# Altium schematic sheet XMAS_2023_SCH.SchDoc
size A4; SheetNumber: 1; SheetTotal: 1
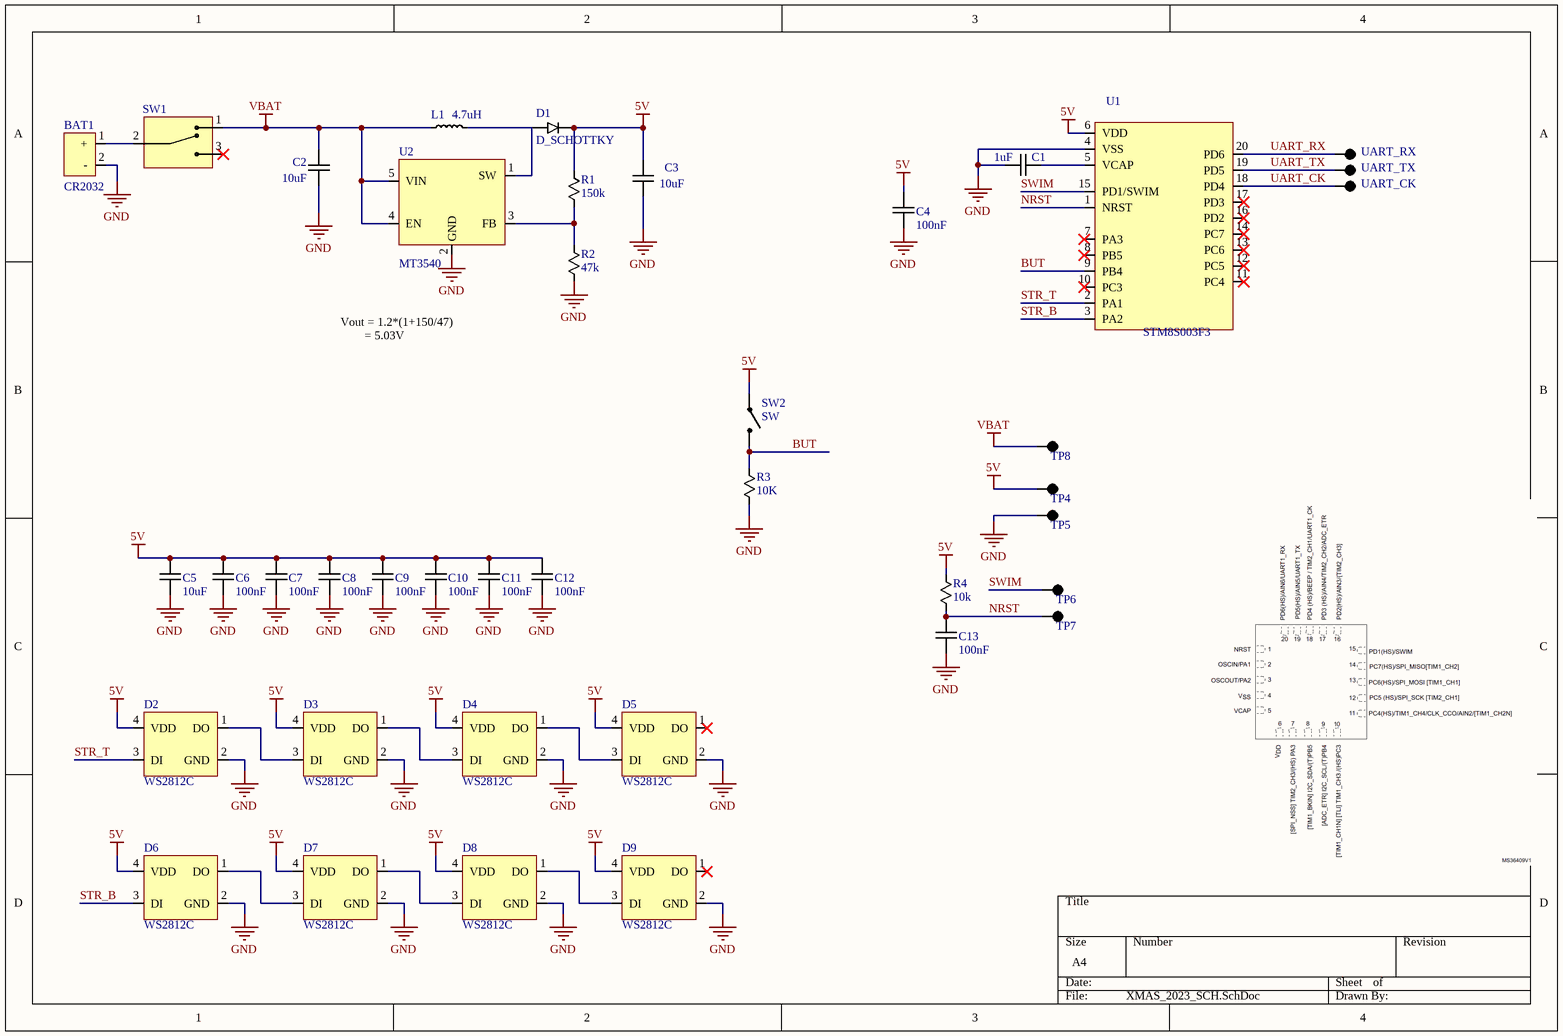
[diagram p0: XMAS_2023_SCH.SchDoc]

## Parts
BAT1  CR2032  [BAT_2032]
C1  1uF  [CAP_0805_NOM]
C2  10uF  [CAP_0805_NOM]
C3  10uF  [CAP_0805_NOM]
C4  100nF  [CAP_0805_NOM]
C5  10uF  [CAP_0805_NOM]
C6  100nF  [CAP_0805_NOM]
C7  100nF  [CAP_0805_NOM]
C8  100nF  [CAP_0805_NOM]
C9  100nF  [CAP_0805_NOM]
C10  100nF  [CAP_0805_NOM]
C11  100nF  [CAP_0805_NOM]
C12  100nF  [CAP_0805_NOM]
C13  100nF  [CAP_0805_NOM]
D1  D_SCHOTTKY  [SOD-523]
D2  WS2812C  [LED_RGB_WS2812C-2020]
D3  WS2812C  [LED_RGB_WS2812C-2020]
D4  WS2812C  [LED_RGB_WS2812C-2020]
D5  WS2812C  [LED_RGB_WS2812C-2020]
D6  WS2812C  [LED_RGB_WS2812C-2020]
D7  WS2812C  [LED_RGB_WS2812C-2020]
D8  WS2812C  [LED_RGB_WS2812C-2020]
D9  WS2812C  [LED_RGB_WS2812C-2020]
L1  4.7uH  [CAP_0805_NOM]
R1  150k  [RES_0805_nom]
R2  47k  [RES_0805_nom]
R3  10K  [RES_0805_nom]
R4  10k  [RES_0805_nom]
SW1  SW_SLIDE_SPDT_MK-12C02-G025  [SW_SLIDE_SPDT_MK-12C02-G025]  (value not drawn)
SW2  SW  [SW_TACT_SPST_TS-1187A]
TP1  UART_RX  [testpoint]  (no BOM)
TP2  UART_TX  [testpoint]  (no BOM)
TP3  UART_CK  [testpoint]  (no BOM)
TP4  TESTPOINT  [testpoint]  (value not drawn)  (no BOM)
TP5  TESTPOINT  [testpoint]  (value not drawn)  (no BOM)
TP6  TESTPOINT  [testpoint]  (value not drawn)  (no BOM)
TP7  TESTPOINT  [testpoint]  (value not drawn)  (no BOM)
TP8  TESTPOINT  [testpoint]  (value not drawn)  (no BOM)
U1  STM8S003F3  [UFQFPN20]
U2  MT3540  [SOT-23 - 5]

## Nets
5V: C3.2 C4.2 C5.2 C6.2 C7.2 C8.2 C9.2 C10.2 C11.2 C12.2 D1.1(Cathode) D2.4(VDD) D3.4(VDD) D4.4(VDD) D5.4(VDD) D6.4(VDD) D7.4(VDD) D8.4(VDD) D9.4(VDD) R1.2 R4.2 SW2.1 TP4.1 U1.6(VDD)
GND: BAT1.2(-) C1.1 C2.1 C3.1 C4.1 C5.1 C6.1 C7.1 C8.1 C9.1 C10.1 C11.1 C12.1 C13.1 D2.2(GND) D3.2(GND) D4.2(GND) D5.2(GND) D6.2(GND) D7.2(GND) D8.2(GND) D9.2(GND) R2.1 R3.1 TP5.1 U1.4(VSS) U2.2(GND)
VBAT: C2.2 L1.1 SW1.1(A) TP8.1 U2.4(EN) U2.5(VIN)
BUT: R3.2 SW2.2 U1.9(PB4)
NRST: C13.2 R4.1 TP7.1 U1.1(NRST)
STR_B: D6.3(DI) U1.3(PA2)
STR_T: D2.3(DI) U1.2(PA1)
SWIM: TP6.1 U1.15(PD1/SWIM)
UART_CK: TP3.1 U1.18(PD4)
UART_RX: TP1.1 U1.20(PD6)
UART_TX: TP2.1 U1.19(PD5)
NetBAT1_1: BAT1.1(+) SW1.2(COM)
NetC1_2: C1.2 U1.5(VCAP)
NetD1_2: D1.2(Anode) L1.2 U2.1(SW)
NetD2_1: D2.1(DO) D3.3(DI)
NetD3_1: D3.1(DO) D4.3(DI)
NetD4_1: D4.1(DO) D5.3(DI)
NetD6_1: D6.1(DO) D7.3(DI)
NetD7_1: D7.1(DO) D8.3(DI)
NetD8_1: D8.1(DO) D9.3(DI)
NetR1_1: R1.1 R2.2 U2.3(FB)

Not connected (* = marked no-connect by the designer): D5 1(DO)*; D9 1(DO)*; SW1 3(B)*; U1 7(PA3)* 8(PB5)* 10(PC3)* 11(PC4)* 12(PC5)* 13(PC6)* 14(PC7)* 16(PD2)* 17(PD3)*

## Notes on the sheet
- Vout = 1.2*(1+150/47)
  = 5.03V

## Library data of the parts
BAT1 = BAT_CR2032: Manufacturer: MYOUNG; Manufacturer Part Number: MY-2032-12; JLCPCB Part Number: C964833
C1-C13 = CAP_0805_10V
D1 = D_SCHOTTKY: 30V 500mV@200mA 200mA SOD-523 Schottky Barrier Diodes (SBD) ROHS; Manufacturer: onsemi; Manufacturer Part Number: RB521S30T1G; JLCPCB Part Number: C145179
D2-D9 = LED_RGB_WS2812C-2020: RGB SMD,2x2mm Light Emitting Diodes (LED) ROHS; Manufacturer: Worldsemi; Manufacturer Part Number: WS2812C-2020-V1; JLCPCB Part Number: C2976072
L1 = IND_4.7uH_0805: 350mA 4.7uH ±20% 400mΩ 0805 Inductors (SMD) ROHS; Manufacturer: FH (Guangdong Fenghua Advanced Tech); Manufacturer Part Number: CMP201209UD4R7MT; JLCPCB Part Number: C139243
R1-R4 = RES_0805
SW1 = SW_SLIDE_SPDT_MK-12C02-G025: Manufacturer: G-Switch; Manufacturer Part Number: MK-12C02-G025; JLCPCB Part Number: C778186
SW2 = SW_SPST_TACT_TS_1187A: No NO 50mA 100000 Times 160gf 12V Brick nogging SPST SMD Tactile Switches ROHS; Manufacturer: XKB Connectivity; Manufacturer Part Number: TS-1187A-B-A-B; JLCPCB Part Number: C318884
TP1-TP8 = TESTPOINT: 1.2mm Test point
U1 = STM8S003F3: 8KB 2.95V~5.5V STM8 1KB 16MHz FLASH 16 UFQFPN-20(3x3) Microcontroller Units (MCUs/MPUs/SOCs) ROHS; Manufacturer: STMicroelectronics; Manufacturer Part Number: STM8S003F3U6TR; JLCPCB Part Number: C35556
U2 = IC_BOOST_MT3540: boost converterType 28V 2.5V~5.5V 1.5A SOT-23-5 DC-DC Converters ROHS; Manufacturer: XI'AN Aerosemi Tech; Manufacturer Part Number: MT3540; JLCPCB Part Number: C181744